# EAGLE schematic arduino_uno_to_atmega_328p (EAGLE 9.1.3)
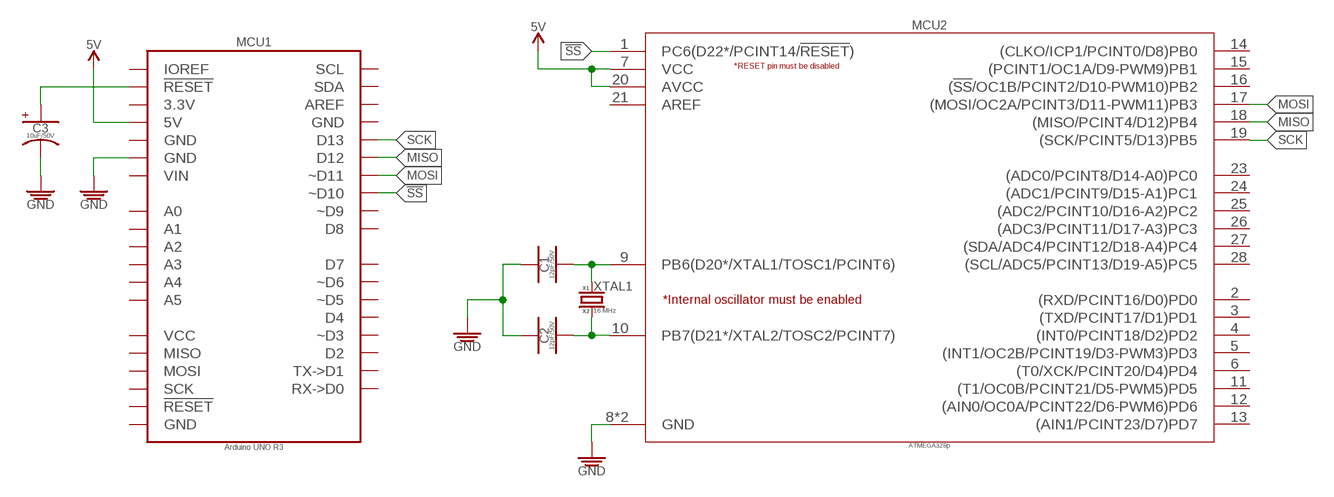
[diagram p0: schematic, sheet 1]

## Parts
C1  12pF/50V  12PF_PTH-CER_50V-5%  [_CER_PTH_LS2.5_L4-W2.5-H5.58]
C2  12pF/50V  12PF_PTH-CER_50V-5%  [_CER_PTH_LS2.5_L4-W2.5-H5.58]
C3  10uF/50V  10UF-POLARIZED_PTH_50V-20%  [_AE_PTH-DIA5-LS2-H5]
MCU1  Arduino UNO R3  ARDUINO_UNO_R3  [ARDUINO_UNO_R3]
MCU2  ATMEGA328p  ATMEGA328P-28_28-PDIP_8BIT_32KB  [DIP762W53P254L3467H472Q28B]
XTAL1  16 MHz  CRYSTAL_ABL_16MHZ_18PF  [HC-49/US]

## Nets
5V: MCU1.5V MCU2.7(VCC) MCU2.20(AVCC)
!SS: MCU1.D10(~D10) MCU2.1(PC6(D22*/PCINT14/!RESET!))
GND: C1.P$1 C2.P$1 C3.-(K) MCU1.GND@3(GND) MCU2.8(GND) MCU2.22(GND)
MISO: MCU1.D12 MCU2.18((MISO/PCINT4/D12)PB4)
MOSI: MCU1.D11(~D11) MCU2.17((MOSI/OC2A/PCINT3/D11-PWM11)PB3)
N$1: C3.+(A) MCU1.RESET@1(!RESET!)
N$2: C2.P$2 MCU2.10(PB7(D21*/XTAL2/TOSC2/PCINT7)) XTAL1.P$2(XTAL2)
N$3: C1.P$2 MCU2.9(PB6(D20*/XTAL1/TOSC1/PCINT6)) XTAL1.P$1(XTAL1)
SCK: MCU1.D13 MCU2.19((SCK/PCINT5/D13)PB5)
Unconnected: MCU1.3.3V MCU1.A0 MCU1.A1 MCU1.A2 MCU1.A3 MCU1.A4 MCU1.A5 MCU1.AREF MCU1.D0(RX->D0) MCU1.D1(TX->D1) MCU1.D2 MCU1.D3(~D3) MCU1.D4 MCU1.D5(~D5) MCU1.D6(~D6) MCU1.D7 MCU1.D8 MCU1.D9(~D9) MCU1.GND@1(GND) MCU1.GND@2(GND) MCU1.GND@4(GND) MCU1.IOREF MCU1.MISO MCU1.MOSI MCU1.RESET@2(!RESET!) MCU1.SCK MCU1.SCL MCU1.SDA MCU1.VCC MCU1.VIN MCU2.2((RXD/PCINT16/D0)PD0) MCU2.3((TXD/PCINT17/D1)PD1) MCU2.4((INT0/PCINT18/D2)PD2) MCU2.5((INT1/OC2B/PCINT19/D3-PWM3)PD3) MCU2.6((T0/XCK/PCINT20/D4)PD4) MCU2.11((T1/OC0B/PCINT21/D5-PWM5)PD5) MCU2.12((AIN0/OC0A/PCINT22/D6-PWM6)PD6) MCU2.13((AIN1/PCINT23/D7)PD7) MCU2.14((CLKO/ICP1/PCINT0/D8)PB0) MCU2.15((PCINT1/OC1A/D9-PWM9)PB1) MCU2.16((!SS!/OC1B/PCINT2/D10-PWM10)PB2) MCU2.21(AREF) MCU2.23((ADC0/PCINT8/D14-A0)PC0) MCU2.24((ADC1/PCINT9/D15-A1)PC1) MCU2.25((ADC2/PCINT10/D16-A2)PC2) MCU2.26((ADC3/PCINT11/D17-A3)PC3) MCU2.27((SDA/ADC4/PCINT12/D18-A4)PC4) MCU2.28((SCL/ADC5/PCINT13/D19-A5)PC5)

## Library data of the parts
C1 C2 = PiB_capacitors:12PF; DATASHEET: http://www.vishay.com/docs/45171/kseries.pdf; DIST: Digikey; DISTLINK: https://www.digikey.com/products/en?keywords=BC1002CT-ND; DISTPN: BC1002CT-ND; MFR: Vishay BC Components; MPN: K120J15C0GF5TL2
C3 = PiB_capacitors:10UF-POLARIZED; DATASHEET: https://industrial.panasonic.com/cdbs/www-data/pdf/RDF0000/ABA0000C1050.pdf; DIST: Digikey; DISTLINK: https://www.digikey.com/products/en/capacitors/aluminum-electrolytic-capacitors/58?k=P828-ND; DISTPN: P828-ND; MFR: Panasonic Electronic Components; MPN: ECE-A1HKA100
MCU1 = PiB_boards:ARDUINO_UNO_R3; DATASHEET: https://media.digikey.com/pdf/Data%20Sheets/Arduino%20PDFs/A000066_Web.pdf; DATASHEET_CABLE: http://www.assmann-wsw.com/fileadmin/datasheets/ASS_7066_CA.pdf; DIST: Digikey; DISTLINK: https://www.digikey.com/products/en?keywords=1050-1024-ND; DISTLINK_CABLE: https://www.digikey.com/products/en?keywords=AE1462-ND; DISTPN: 1050-1024-ND; DISTPN_CABLE: AE1462-ND; DIST_CABLE: Digikey; MFR: Arduino; MFR_CABLE: Assmann WSW Components; MPN: A000066; MPN_CABLE: AK672/2-1
MCU2 = PiB_ic_microcontrollers:ATMEGA328P-28: ATMEGA328P 28PIN IC; DATASHEET: http://ww1.microchip.com/downloads/en/DeviceDoc/Atmel-42735-8-bit-AVR-Microcontroller-ATmega328-328P_Datasheet.pdf; DIST: Digikey; DISTLINK: https://www.digikey.com/products/en?keywords=ATMEGA328P-PU-ND; DISTPN: ATMEGA328P-PU-ND; MFR: Microchip Technology; MPN: ATMEGA328P-PU
XTAL1 = PiB_crystals_oscillators_resonators:CRYSTAL: Various standard crystals. Proven footprints.; DATASHEET: https://abracon.com/Resonators/ABL.pdf; DIST: Digikey; DISTLINK: https://www.digikey.com/products/en?keywords=535-9041-ND; DISTPN: 535-9041-ND; MFR: Abracon LLC; MPN: ABL-16.000MHZ-B2